# Altium schematic sheet Voltage Regulators.SchDoc
size B; SheetNumber: 3; SheetTotal: 4
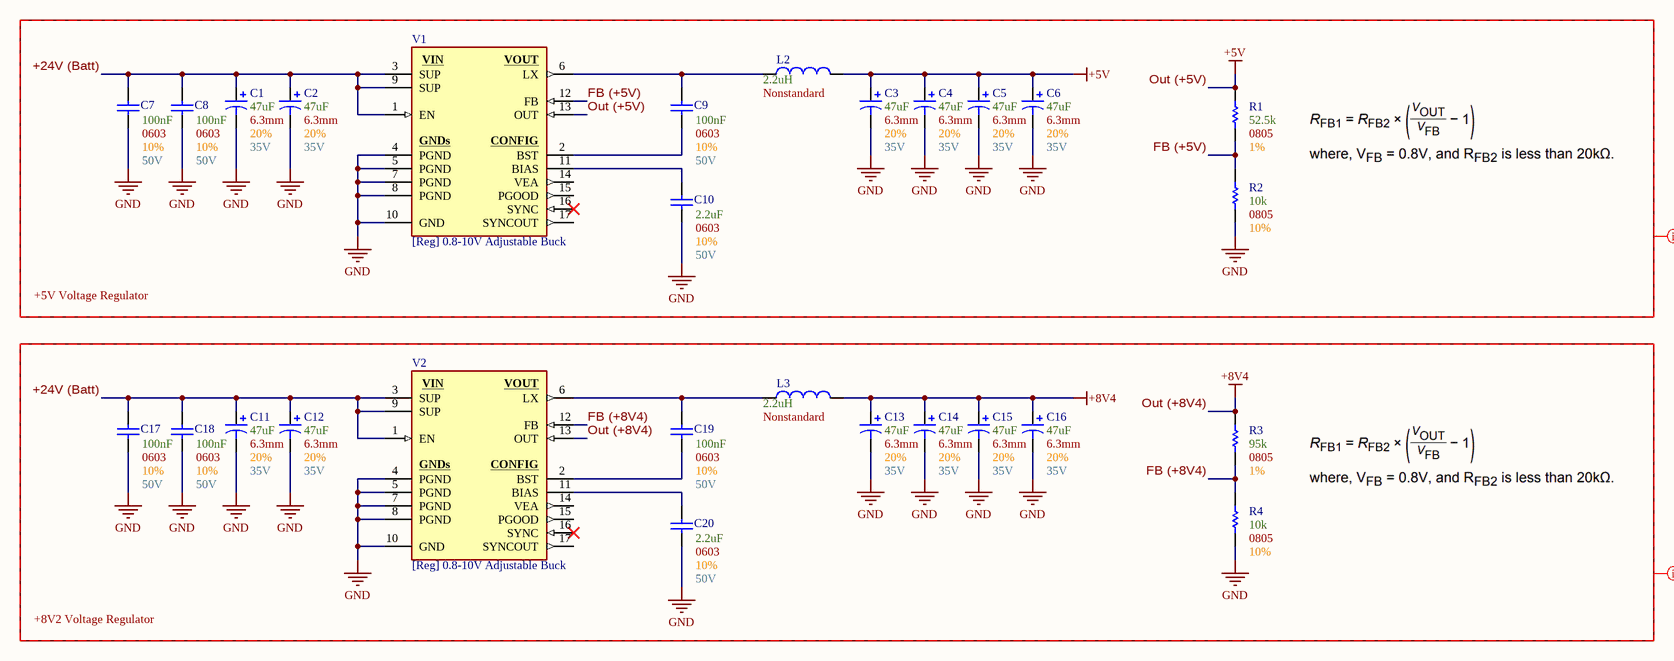
[diagram p0: Voltage Regulators.SchDoc]

## Parts
C1  Tolerance: 20%  Max Voltage: 35V  Capacitance: 47uF  Diameter: 6.3mm  [[Cap] SMD Polarized, 6.3mm]  (hidden comment: SMD Polarized)
C2  Tolerance: 20%  Max Voltage: 35V  Capacitance: 47uF  Diameter: 6.3mm  [[Cap] SMD Polarized, 6.3mm]  (hidden comment: SMD Polarized)
C3  Tolerance: 20%  Max Voltage: 35V  Capacitance: 47uF  Diameter: 6.3mm  [[Cap] SMD Polarized, 6.3mm]  (hidden comment: SMD Polarized)
C4  Tolerance: 20%  Max Voltage: 35V  Capacitance: 47uF  Diameter: 6.3mm  [[Cap] SMD Polarized, 6.3mm]  (hidden comment: SMD Polarized)
C5  Tolerance: 20%  Max Voltage: 35V  Capacitance: 47uF  Diameter: 6.3mm  [[Cap] SMD Polarized, 6.3mm]  (hidden comment: SMD Polarized)
C6  Tolerance: 20%  Max Voltage: 35V  Capacitance: 47uF  Diameter: 6.3mm  [[Cap] SMD Polarized, 6.3mm]  (hidden comment: SMD Polarized)
C7  Voltage: 50V  Tolerance: 10%  Size Package: 0603  Capacitance: 100nF  [[Cap] SMD 0603]  (hidden comment: SMD Nonpolarized)
C8  Voltage: 50V  Tolerance: 10%  Size Package: 0603  Capacitance: 100nF  [[Cap] SMD 0603]  (hidden comment: SMD Nonpolarized)
C9  Voltage: 50V  Tolerance: 10%  Size Package: 0603  Capacitance: 100nF  [[Cap] SMD 0603]  (hidden comment: SMD Nonpolarized)
C10  Voltage: 50V  Tolerance: 10%  Size Package: 0603  Capacitance: 2.2uF  [[Cap] SMD 0603]  (hidden comment: SMD Nonpolarized)
C11  Tolerance: 20%  Max Voltage: 35V  Capacitance: 47uF  Diameter: 6.3mm  [[Cap] SMD Polarized, 6.3mm]  (hidden comment: SMD Polarized)
C12  Tolerance: 20%  Max Voltage: 35V  Capacitance: 47uF  Diameter: 6.3mm  [[Cap] SMD Polarized, 6.3mm]  (hidden comment: SMD Polarized)
C13  Tolerance: 20%  Max Voltage: 35V  Capacitance: 47uF  Diameter: 6.3mm  [[Cap] SMD Polarized, 6.3mm]  (hidden comment: SMD Polarized)
C14  Tolerance: 20%  Max Voltage: 35V  Capacitance: 47uF  Diameter: 6.3mm  [[Cap] SMD Polarized, 6.3mm]  (hidden comment: SMD Polarized)
C15  Tolerance: 20%  Max Voltage: 35V  Capacitance: 47uF  Diameter: 6.3mm  [[Cap] SMD Polarized, 6.3mm]  (hidden comment: SMD Polarized)
C16  Tolerance: 20%  Max Voltage: 35V  Capacitance: 47uF  Diameter: 6.3mm  [[Cap] SMD Polarized, 6.3mm]  (hidden comment: SMD Polarized)
C17  Voltage: 50V  Tolerance: 10%  Size Package: 0603  Capacitance: 100nF  [[Cap] SMD 0603]  (hidden comment: SMD Nonpolarized)
C18  Voltage: 50V  Tolerance: 10%  Size Package: 0603  Capacitance: 100nF  [[Cap] SMD 0603]  (hidden comment: SMD Nonpolarized)
C19  Voltage: 50V  Tolerance: 10%  Size Package: 0603  Capacitance: 100nF  [[Cap] SMD 0603]  (hidden comment: SMD Nonpolarized)
C20  Voltage: 50V  Tolerance: 10%  Size Package: 0603  Capacitance: 2.2uF  [[Cap] SMD 0603]  (hidden comment: SMD Nonpolarized)
L2  Size Package: Nonstandard  Inductance: 2.2uH  [[Inductor] 7.4 X 6.6 X 3 MM]  (hidden comment: SMD Inductor)
L3  Size Package: Nonstandard  Inductance: 2.2uH  [[Inductor] 7.4 X 6.6 X 3 MM]  (hidden comment: SMD Inductor)
R1  Tolerance: 1%  Resistance: 52.5k  Size Package: 0805  [[Res] SMD 0805]  (hidden comment: [Res] SMD Resistor)
R2  Tolerance: 10%  Resistance: 10k  Size Package: 0805  [[Res] SMD 0805]  (hidden comment: [Res] SMD Resistor)
R3  Tolerance: 1%  Resistance: 95k  Size Package: 0805  [[Res] SMD 0805]  (hidden comment: [Res] SMD Resistor)
R4  Tolerance: 10%  Resistance: 10k  Size Package: 0805  [[Res] SMD 0805]  (hidden comment: [Res] SMD Resistor)
V1  [Reg] 0.8-10V Adjustable Buck  [[Reg] 0.8-10V Adjustable Buck]
V2  [Reg] 0.8-10V Adjustable Buck  [[Reg] 0.8-10V Adjustable Buck]

## Blocks framed on the sheet
+5V Voltage Regulator: C1-C10 L2 R1 R2 V1
+8V2 Voltage Regulator: C11-C20 L3 R3 R4 V2

## Nets
GND: C1.2 C2.2 C3.2 C4.2 C5.2 C6.2 C7.1 C8.1 C10.1 C11.2 C12.2 C13.2 C14.2 C15.2 C16.2 C17.1 C18.1 C20.1 R2.1 R4.1 V1.4(PGND) V1.5(PGND) V1.7(PGND) V1.8(PGND) V1.10(GND) V2.4(PGND) V2.5(PGND) V2.7(PGND) V2.8(PGND) V2.10(GND)
Out (+5V): C3.1 C4.1 C5.1 C6.1 L2.2 R1.2 V1.13(OUT)  [also labelled +5V]
Out (+8V4): C13.1 C14.1 C15.1 C16.1 L3.2 R3.2 V2.13(OUT)  [also labelled +8V4]
+24V (Batt): C1.1 C2.1 C7.2 C8.2 C11.1 C12.1 C17.2 C18.2 V1.1(EN) V1.3(SUP) V1.9(SUP) V2.1(EN) V2.3(SUP) V2.9(SUP)
FB (+5V): R1.1 R2.2 V1.12(FB)
FB (+8V4): R3.1 R4.2 V2.12(FB)
NetC9_1: C9.1 V1.2(BST)
NetC9_2: C9.2 L2.1 V1.6(LX)
NetC10_2: C10.2 V1.11(BIAS)
NetC19_1: C19.1 V2.2(BST)
NetC19_2: C19.2 L3.1 V2.6(LX)
NetC20_2: C20.2 V2.11(BIAS)

Not connected (* = marked no-connect by the designer): V1 14(VEA) 15(PGOOD) 16(SYNC)* 17(SYNCOUT); V2 14(VEA) 15(PGOOD) 16(SYNC)* 17(SYNCOUT)

## Layout directives
net class Supply_Nets: +5V, +8V4, +24V (Batt), FB (+5V), FB (+8V4), GND, Out (+5V), Out (+8V4)

## Notes on the sheet
- (in symbol [Reg] 0.8-10V Adjustable Buck) VIN; VOUT; GNDs; CONFIG

## Library data of the parts
C1-C6 C11-C16 = [Cap] SMD Polarized: Supplier 1: DigiKey; Supplier Part Number 1: PCE3842CT-ND
C7-C10 C17-C20 = [Cap] SMD Nonpolarized: Supplier 1: DigiKey
  C7-C9 C17-C19: Supplier Part Number 1: 1276-1003-1-ND
  C10 C20: Supplier Part Number 1: 1276-1134-1-ND
L2 L3 = [Inductor] SMD Inductor: JLC Part #: *; Mouser Part #: *; Supplier 1: DigiKey; Supplier Part Number 1: XC2402CT-ND
R1-R4 = [Res] SMD Resistor: Generic; Supplier 1: DigiKey
  R1: Supplier Part Number 1: 311-52.3KCRCT-ND
  R2 R4: Supplier Part Number 1: RR12P10.0KDCT-ND
  R3: Supplier Part Number 1: RMCF0805FT95K3DKR-ND
V1 V2 = [Reg] 0.8-10V Adjustable Buck: MAX20408AFOF/VY+; Supplier 1: DigiKey; Supplier Part Number 1: 505-MAX20408AFOF/VY+-ND